# Altium schematic sheet IFX9201_Core.SchDoc
size A4
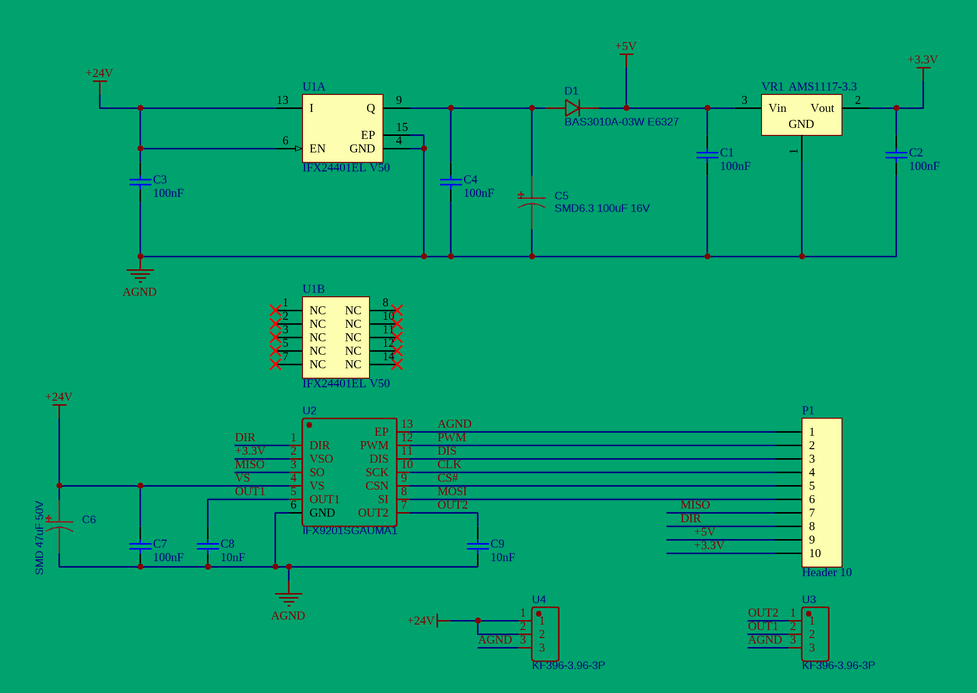
[diagram p0: IFX9201_Core.SchDoc]

## Parts
C1  100nF  [0603_C]
C2  100nF  [0603_C]
C3  100nF  [0603_C]
C4  100nF  [0603_C]
C5  SMD6.3 100uF 16V  [CAP-SMD_BD6.3-L6.6-W6.6-FD]
C6  SMD 47uF 50V  [CAP-SMD_BD6.3-L6.6-W6.6-FD]
C7  100nF  [0603_C]
C8  10nF  [0603_C]
C9  10nF  [0603_C]
D1  BAS3010A-03W E6327  [SOD-323_L1.8-W1.3-LS2.5-RD]
P1  Header 10  [HDR1X10]
U1  IFX24401EL V50  [INF-PG-SSOP-14-1_N]  (parts A,B of 2)
U2  IFX9201SGAUMA1  [SO-12_L6.4-W7.5-P1.00-LS10.3-BL-EP]
U3  KF396-3.96-3P  [CONN-TH_3P-P3.96_KF396-3.96-3P]
U4  KF396-3.96-3P  [CONN-TH_3P-P3.96_KF396-3.96-3P]
VR1  AMS1117-3.3  [SOT-223]

## Nets
+3.3V: C2.2 P1.10 U2.2(VSO) VR1.2(Vout)
+5V: C1.2 D1.1(C) P1.9 VR1.3(Vin)
AGND: C1.1 C2.1 C3.1 C4.1 C5.2 C6.2 C7.1 C8.1 C9.1 P1.1 U1.4(GND) U1.15(EP) U2.6(GND) U2.13(EP) U3.3 U4.3 VR1.1(GND)
VS: C3.2 C6.1 C7.2 U1.6(EN) U1.13(I) U2.4(VS) U4.1 U4.2  [also labelled +24V]
CLK: P1.4 U2.10(SCK)
CS#: P1.5 U2.9(CSN)
DIR: P1.8 U2.1(DIR)
DIS: P1.3 U2.11(DIS)
MISO: P1.7 U2.3(SO)
MOSI: P1.6 U2.8(SI)
OUT1: C8.2 U2.5(OUT1) U3.2
OUT2: C9.2 U2.7(OUT2) U3.1
PWM: P1.2 U2.12(PWM)
NetC4_2: C4.2 C5.1 D1.2(A) U1.9(Q)

Not connected (* = marked no-connect by the designer): U1 1(NC)* 2(NC)* 3(NC)* 5(NC)* 7(NC)* 8(NC)* 10(NC)* 11(NC)* 12(NC)* 14(NC)*

## Library data of the parts
C1-C4 C7 = 0603 2.7nF (272) 10% 50V: GCJ188R72A104KA01D; ComponentLink1Description: muRata; Package: 0603
C5 = SMD6.3 100uF: UUD1C101MCL1GS; BOM_Manufacturer: Nichicon; BOM_Manufacturer Part: UUD1C101MCL1GS
C6 = SMD6.3 100uF: EEEFT1H470AP; BOM_Manufacturer: PANASONIC; BOM_Manufacturer Part: EEEFT1H470AP; Package: SMD,6.3x5.8mm
C8 C9 = 0603 2.7nF (272) 10% 50V: GCM188R72A103KA37D; Replace: TCC0603X7R103K251CT; ComponentLink1Description: muRata; Package: 0603
D1 = BAS3010A-03W E6327: BOM_Manufacturer: Infineon Technologies; BOM_Manufacturer Part: BAS 3010A-03W E6327
P1 = Header 10: Header, 10-Pin; LatestRevisionDate: 17-Jul-2002; LatestRevisionNote: Re-released for DXP Platform.; Publisher: Altium Limited
U1 = IFX24401EL V50: Low Dropout Voltage Regulator, 5.5 to 42 V Operating, 300 mA, -40 to 125 degC, PG-SSOP-14-1, Reel, Green; Manufacturer: Infineon; Accuracy: 2.0 %; Automotive Qualified: FALSE; Dropout Voltage: 250 mV; Green: TRUE; Max Number Reflow: 3; Max Peak Reflow Temp: 260 degC; Max. Output Current: 300 mA; Output Voltage: 5 V; Regulator Type: Linear->single output; Typical Quiescent Current: 20 uA; DatasheetVersion: Rev. 1.02; PackageVersion: Oct-08; PackageReference: PG-SSOP-14-1; PackageDescription: 14-Pin Plastic (Green) Shrink Small Outline Package, 4.9 x 3.9 mm Body, 0.65 mm Pitch; Supplier 1: Mouser; Supplier Part Number 1: 726-IFX24401ELV50; Supplier 2: Digi-Key; Supplier Part Number 2: IFX24401EL V50INTR-ND; Supplier 3: Digi-Key; Supplier Part Number 3: IFX24401EL V50INCT-ND; Supplier 4: Digi-Key; Supplier Part Number 4: IFX24401EL V50INDKR-ND; Halogen-free: TRUE; MSL: 3; Packing: Reel; Reset: FALSE; Status Output: FALSE; Mounting Technology: Surface Mount; PartNumber: IFX24401EL V50; ComponentLink1Description: Manufacturer URL; ComponentLink1URL: http://www.infineon.com/; ComponentLink2Description: Datasheet; ComponentLink2URL: http://www.infineon.com/dgdl/IFX24401_DS_102.pdf?folderId=db3a30431ff988150120802bce1d257a&fileId=db3a304320d39d590120f61fb4d269d5; ComponentLink3Description: Package Specification; ComponentLink3URL: http://www.infineon.com/dgdl/PG-SSOP-14-1%2C-2%2C-3-Package_Overview.pdf?folderId=db3a304319bc939a0119bdaa53bc000b&fileId=db3a30431cdffaa4011ce10d798a0009
U2 = IFX9201SGAUMA1: BOM_Manufacturer: Infineon; BOM_Manufacturer Part: IFX9201SGAUMA1
U3 U4 = KF396-3.96-3P: BOM_Manufacturer: Cixi Kefa Elec; Contributor: LCSC; BOM_Supplier: LCSC; BOM_Supplier Part: C474895; BOM_Manufacturer Part: KF396-3.96-3P; spicePre: U; spiceSymbolName: KF396-3.96-3P
VR1 = SOT-223 AMS1117-3.3: 低压差线性稳压(LDO); ComponentLink1Description: 供应商链接; ComponentLink1URL: http://www.szlcsc.com/product/details_6652.html; Package: SOT-223; Supplier: LC; SuppliersPartNumber: C6186